# Altium schematic sheet ADC.SchDoc: Oscilly AFE Schematic
size A4; ApprovedBy: Ibrahim Khalid; Author: Ibrahim Khalid; CompanyName: Oscilly; DrawnBy: Ibrahim Khalid; DocumentNumber: Page 3 of 4; Revision: 1.0; SheetNumber: 3; SheetTotal: 4
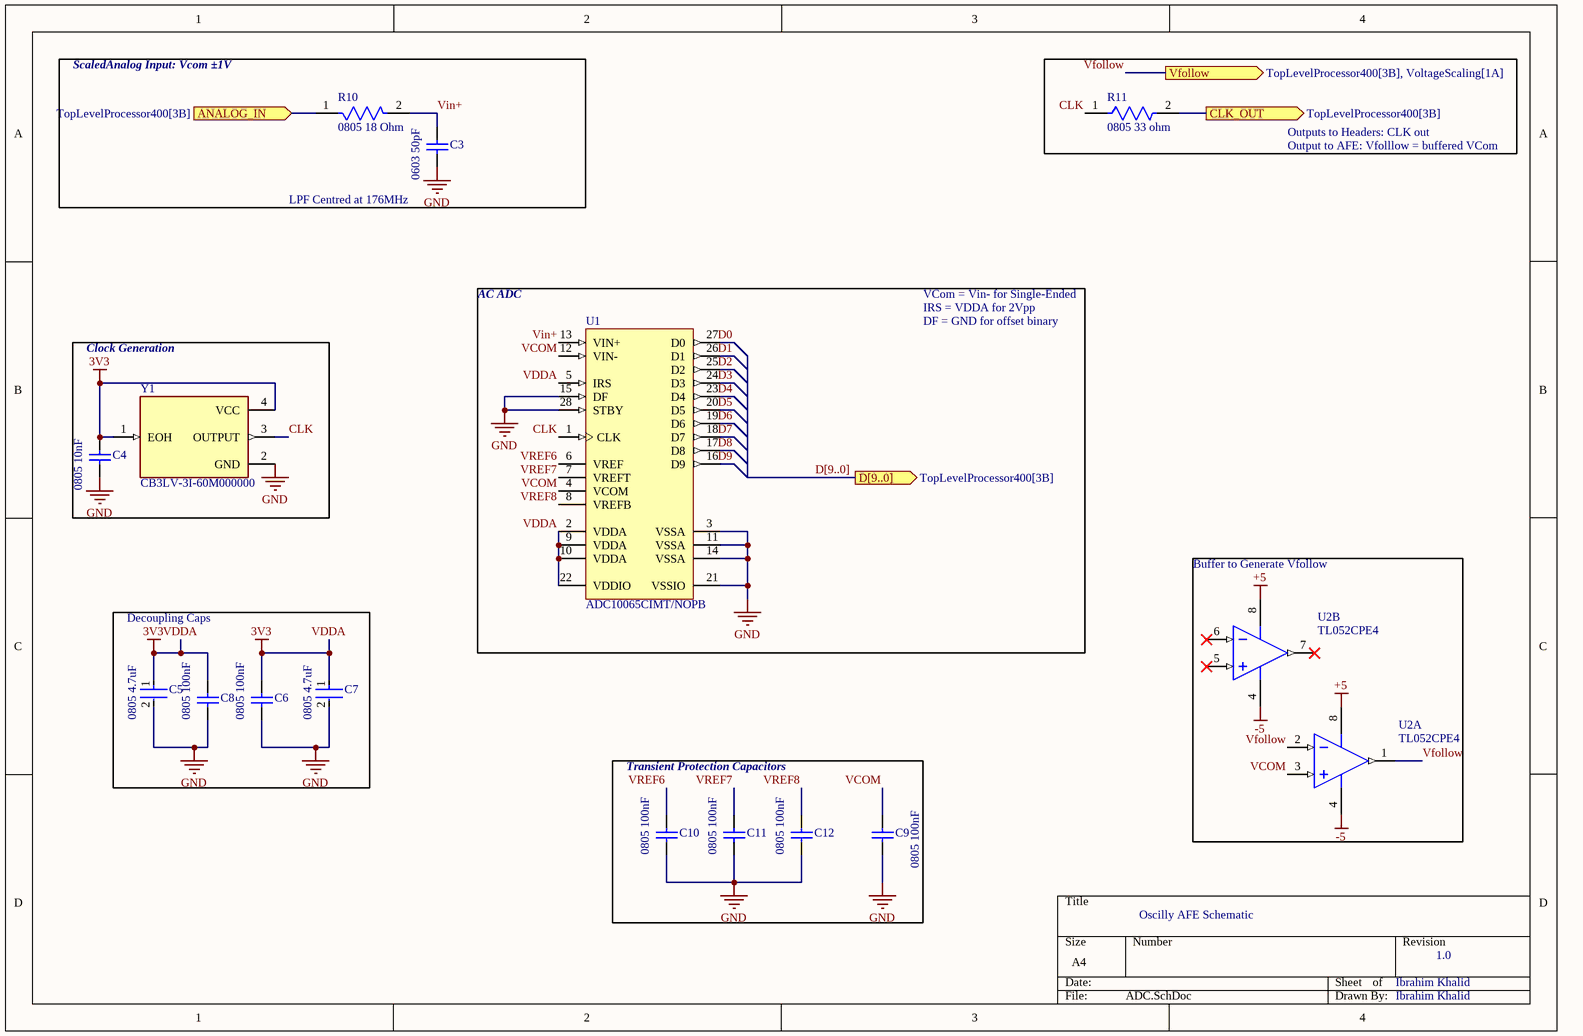
[diagram p0: ADC.SchDoc]

## Parts
C3  0603 50pF  [CAPC1608X90X35ML15T15]
C4  0805 10nF  [CAPC0805(2012)100_M]
C5  0805 4.7uF  [FP-CC0805-0_85-MFG]
C6  0805 100nF  [CAPC2013X140X50ML20T25]
C7  0805 4.7uF  [FP-CC0805-0_85-MFG]
C8  0805 100nF  [CAPC2013X140X50ML20T25]
C9  0805 100nF  [CAPC2013X140X50ML20T25]
C10  0805 100nF  [CAPC2013X140X50ML20T25]
C11  0805 100nF  [CAPC2013X140X50ML20T25]
C12  0805 100nF  [CAPC2013X140X50ML20T25]
R10  0805 18 Ohm  [FP-CR0805-IPC_B]
R11  0805 33 ohm  [FP-AC0805-MFG]
U1  ADC10065CIMT/NOPB  [PW0028A_L]
U2  TL052CPE4  [TI-P8]  (parts A,B of 2)
Y1  CB3LV-3I-60M000000  [OSC_CB3LV-3I-60M000000]

## Blocks framed on the sheet
Clock Generation: C4 Y1
Buffer to Generate Vfollow: U2
Decoupling Caps: C5-C8
Transient Protection Capacitors: C9-C12

## Ports
ANALOG_IN (in, see TopLevelProcessor400[3B]), CLK_OUT (out, see TopLevelProcessor400[3B]), D[9..0] (out, see TopLevelProcessor400[3B]), Vfollow (out, see TopLevelProcessor400[3B], VoltageScaling[1A])

## Nets
+5: U2.8(VCC+)
-5: U2.4(VCC-)
GND: C3.2 C4.2 C5.2 C6.2 C7.2 C8.2 C9.2 C10.2 C11.2 C12.2 U1.3(VSSA) U1.11(VSSA) U1.14(VSSA) U1.15(DF) U1.21(VSSIO) U1.28(STBY) Y1.2(GND)
VDDA: C4.1 C5.1 C6.1 C7.1 C8.1 U1.2(VDDA) U1.5(IRS) U1.9(VDDA) U1.10(VDDA) U1.22(VDDIO) Y1.1(EOH) Y1.4(VCC)  [also labelled 3V3]
ANALOG_IN: R10.1 ; port ANALOG_IN
CLK: R11.1 U1.1(CLK) Y1.3(OUTPUT)
CLK_OUT: R11.2 ; port CLK_OUT
D0: U1.27(D0)
D1: U1.26(D1)
D2: U1.25(D2)
D3: U1.24(D3)
D4: U1.23(D4)
D5: U1.20(D5)
D6: U1.19(D6)
D7: U1.18(D7)
D8: U1.17(D8)
D9: U1.16(D9)
VCOM: C9.1 U1.4(VCOM) U1.12(VIN-) U2.3(IN1+)
Vfollow: U2.1(OUT1) U2.2(IN1-) ; port Vfollow
Vin+: C3.1 R10.2 U1.13(VIN+)
VREF6: C10.1 U1.6(VREF)
VREF7: C11.1 U1.7(VREFT)
VREF8: C12.1 U1.8(VREFB)

Not connected (* = marked no-connect by the designer): U2 5(IN2+)* 6(IN2-)* 7(OUT2)*

## Buses and harness runs
bus D[9..0] = port D[9..0]

## Notes on the sheet
- ScaledAnalog Input: Vcom ±1V
- Outputs to Headers: CLK out
- Output to AFE: Vfolllow = buffered VCom
- (near C3) LPF Centred at 176MHz
- AC ADC
- VCom = Vin- for Single-Ended
- IRS = VDDA for 2Vpp
- DF = GND for offset binary

## Library data of the parts
C3 = CMP-2006-04331-1: 06035A500JAT2A; Manufacturer: AVX Interconnect / Elco; Part Number: 06035A500JAT2A
C4 = CMP-1036-03863-1: CAP 10nF 200V ±20% 0805 (2012 Metric) Thickness 1mm SMD; Case-EIA: 0805; Tolerance: Â±20%; Case-Metric: 2012; Technology: SMT; Value: 10nF; Rated Voltage: 200 V; Max Thickness: 1 mm
C5 C7 = CMP-03422-000207-1: CAP CER 4.7UF 16V X7R 0805   CC0805KKX7R7BB475; Manufacturer: Yageo; Tolerance: 0.1; Material: Ceramic; Footprint Url: http://www.yageo.com/exep/pages/download/literatures/UPY-C_GEN_24.pdf; Device Class L3: Ceramic Capacitors; Temperature: -30°C to +85°C; Device Class L2: Capacitors; Automotive: No; Digikey Description: CAP CER 4.7UF 16V X7R 0805; Temperature Range High: +85°C; Lead Free: Yes; Mouser Description: Multilayer Ceramic Capacitors MLCC - SMD/SMT 4.7M pF 10% 16 Volts; Temperature Characteristic: X7R; Height: 0.95mm; Device Class L1: Passive Components; ComponentLink2Description: Datasheet; Category: Cap; Octopart: https://octopart.com/cc0805kkx7r7bb475-yageo-34429188; Temperature Range Low: -30°C; Manufacturer Part Number: CC0805KKX7R7BB475; Package: CC0805-0.85; Ipc Land Pattern Name: CAPC200125X85; RoHS: TRUE; Value: 4.7 uF; Capacitance: 4.7 uF; ComponentLink2URL: http://www.yageo.com/documents/recent/UPY-GPHC_Y5V_6.3V-to-50V_8.pdf; Voltage Rating: 16 V
C6 C8-C12 = CMP-2007-04651-1: 0805DD104KAT2A; Manufacturer: AVX Interconnect / Elco; Part Number: 0805DD104KAT2A
R10 = CMP-07231-001839-1: Thick Film Chip Resistors 0805 18Ω 0.125W 5% 200ppm/°C  CR0805-JW-180ELF; Power Rating: 125mW; Voltage Rating: 150V; Resistance: 18R; Max Operating Temperature: 155°C; Radiation Hardening: No; Packaging: Tape and Reel; Height: 0.024inch; Tolerance: 5%; Min Operating Temperature: -55°C; Thickness: 508um; Case/Package: 0805; Termination: SMD/SMT; Package Quantity: 5000; Contact Plating: Tin; Number of Terminations: 2; Military Standard: Not; Case Code (Metric): 2012; Composition: Thick Film; Width: 0.049inch; Max Power Dissipation: 125mW; Features: Moisture Resistant; Length: 2mm; Temperature Coefficient: 200ppm/°C; Case Code (Imperial): 0805; Depth: 1.25mm; Mount: Surface Mount
R11 = CMP-03412-037241-1: RES SMD 33 OHM 1% 1/8W 0805; Manufacturer: Yageo; Manufacturer Part Number: AC0805FR-0733RL; Automotive Grade: Grade 0; Value: 33Ω; Voltage Rating: 150V; Tolerance: 0.01; Octopart: https://octopart.com/ac0805fr-0733rl-yageo-46503501; Device Class L2: Resistors; Temperature: -55°C to +155°C; Composition: Thick Film; ComponentLink2URL: http://www.yageo.com/documents/recent/PYu-AC_51_RoHS_L_6.pdf; Automotive: Yes; Lead Free: Yes; Category: Res; Package: AC0805; Temperature Range Low: -55°C; Device Class L3: Chip SMD Resistors; Temperature Range High: +155°C; Mouser Description: Thick Film Resistors - SMD 1/8W 33ohm 1% AEC-Q200; Footprint Url: http://www.yageo.com/exep/pages/download/literatures/PYu-R_Mount_10.pdf; Resistance: 33Ω; Power Rating: 1/8W; RoHS: TRUE; ComponentLink2Description: Datasheet; Device Class L1: Passive Components; Height: 0.6mm; Series: AC; Digikey Description: RES SMD 33 OHM 1% 1/8W 0805; Ipc Land Pattern Name: RESC200125X50
U1 = CMP-0054-00382-3: 10-Bit 65 MSPS 3V A/D Converter, 28-pin TSSOP, Pb-Free; Manufacturer: Texas Instruments; CompType: ADC IC; PowerWise: Y; PackageTopMarking: NSUZXYTTE#*ADC10065*CIMT; Code_JEDEC: MO-153-AE; PackageReference: PW0028A; RoHS: Y; PackageDescription: Molded TSSOP, Jedec, 9.7 x 4.4 x 0.9mm Body, 28 Lead, 0.65mm Pitch; ComponentLink1Description: Datasheet URL; ComponentLink1URL: http://www.ti.com/general/docs/lit/getliterature.tsp?genericPartNumber=ADC10065&fileType=pdf; PinCount: 28
U2 = CMP-0017-01039-1: Dual Enhanced JFET Precision Operational Amplifier, 10 to 30 V, 0 to 70 degC, 8-pin DIP (P8), Pb-Free (RoHS); Manufacturer: Texas Instruments; Total Supply Voltage(Max)(+5V is 5, +/-5V is 10): 30; Vio (25C)(Max)(mV): 1.5; Iq per channel(Max)(mA): 2.8; Slew Rate(Typ)(V/us): 20.7; Offset Drift(Typ)(uV/C): 8; GBW(Typ)(MHz): 3; Total Supply Voltage(Min)(+5V is 5, +/-5V is 10): 10; CMRR(Min)(dB): 75; Sub Family: General Purpose Amplifier, High Supply Voltage Amplifier (>=30V); Vn at 1kHz(Typ)(nV/rtHz): 19; Rating: Military; IIB(Max)(pA): 200; Number of Channels: 2; PackageDescription: 8-Pin Plastic In-Line, Body 9.59 x 6.35 mm, Pitch 2.54 mm; ComponentLink1Description: Manufacturer URL; PackageReference: P8; ComponentLink2Description: Datasheet; Code_JEDEC: MS-001; ComponentLink3URL: http://www.ti.com/litv/pdf/mpdi001b; ComponentLink3Description: Package Specification; Mounting Technology: Through Hole; ComponentLink2URL: http://www.ti.com/lit/ds/symlink/tl052.pdf; Eco-Plan: Pb-Free (RoHS); PartNumber: TL052CPE4; ComponentLink1URL: http://www.ti.com/; PackageVersion: 4040082/E, 04/2010; DatasheetVersion: SLOS178A
Y1 = CMP-011-000000-1: 60 MHz XO (Standard) HCMOS, TTL Oscillator 3.3V Enable/Disable 4-SMD, No Lead; MF: CTS-Frequency Controls; Pin Count: 4; Component Type: Standard; Check_prices: https://www.snapeda.com/parts/CB3LV-3I-60M000000/CTS-Frequency+Controls/view-part/?ref=eda; Design Item ID: CB3LV-3I-60M000000; Source: CB3LV-3I-60M000000.SchLib; Package: NON STANDARD-4 CTS; Value: *; MP: CB3LV-3I-60M000000; SnapEDA_Link: https://www.snapeda.com/parts/CB3LV-3I-60M000000/CTS-Frequency+Controls/view-part/?ref=snap